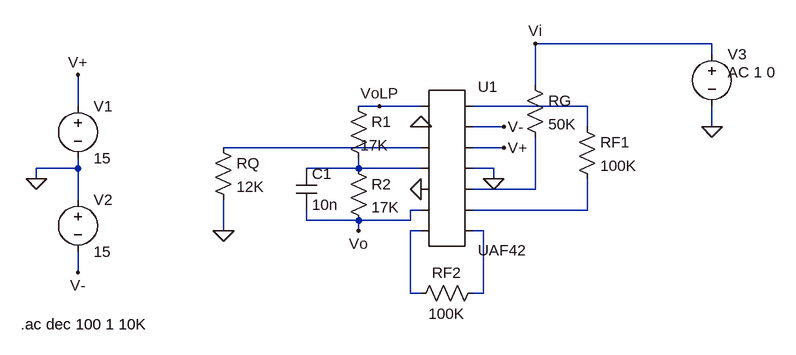
[diagram p0: schematic UAF42.asc]
UAF42.asc, the LTspice schematic file:
Version 4
SHEET 1 948 680
WIRE 848 -80 576 -80
WIRE 848 -64 848 -80
WIRE 576 -16 576 -80
WIRE -128 16 -128 -32
WIRE 336 16 304 16
WIRE 400 16 336 16
WIRE 656 16 480 16
WIRE 528 48 480 48
WIRE 656 48 656 16
WIRE 848 48 848 16
WIRE 400 80 96 80
WIRE 528 80 480 80
WIRE -128 112 -128 96
WIRE -128 112 -192 112
WIRE 304 112 304 96
WIRE 304 112 224 112
WIRE 400 112 304 112
WIRE 512 112 480 112
WIRE -192 128 -192 112
WIRE 512 128 512 112
WIRE 576 144 576 64
WIRE 576 144 480 144
WIRE -128 160 -128 112
WIRE 400 176 384 176
WIRE 656 176 656 128
WIRE 656 176 480 176
WIRE 224 192 224 176
WIRE 304 192 224 192
WIRE 384 192 384 176
WIRE 384 192 304 192
WIRE 96 208 96 160
WIRE 304 208 304 192
WIRE 400 208 384 208
WIRE 496 208 480 208
WIRE -128 272 -128 240
WIRE 384 304 384 208
WIRE 400 304 384 304
WIRE 496 304 496 208
WIRE 496 304 480 304
FLAG 576 -80 Vi
FLAG 96 208 0
FLAG 528 80 V+
FLAG -128 -32 V+
FLAG 528 48 V-
FLAG -128 272 V-
FLAG -192 128 0
FLAG 512 128 0
FLAG 336 16 VoLP
FLAG 304 208 Vo
FLAG 848 48 0
FLAG 400 48 0
FLAG 400 144 0
SYMBOL AutoGenerated\\UAF42 432 112 R0
SYMATTR InstName U1
SYMBOL res 640 32 R0
SYMATTR InstName RF1
SYMATTR Value 100K
SYMBOL res 496 288 R90
WINDOW 0 0 56 VBottom 2
WINDOW 3 32 56 VTop 2
SYMATTR InstName RF2
SYMATTR Value 100K
SYMBOL res 560 -32 R0
SYMATTR InstName RG
SYMATTR Value 50K
SYMBOL res 80 64 R0
SYMATTR InstName RQ
SYMATTR Value 12K
SYMBOL voltage -128 0 R0
SYMATTR InstName V1
SYMATTR Value 15
SYMBOL voltage -128 144 R0
SYMATTR InstName V2
SYMATTR Value 15
SYMBOL res 288 0 R0
WINDOW 3 19 76 Left 2
SYMATTR Value 17K
SYMATTR InstName R1
SYMBOL res 288 96 R0
SYMATTR InstName R2
SYMATTR Value 17K
SYMBOL cap 208 112 R0
SYMATTR InstName C1
SYMATTR Value 10n
SYMBOL voltage 848 -80 R0
WINDOW 123 24 44 Left 2
WINDOW 39 0 0 Left 0
SYMATTR Value2 AC 1 0
SYMATTR InstName V3
SYMATTR Value ""
TEXT -216 352 Left 2 !.ac dec 100 1 10K

The netlist it stands for:
* UAF42.asc
* U1: UAF42 (symbol AutoGenerated\UAF42 not available, pins judged from their places): pin1=VoLP pin2=0 pin3=N002 pin4=N003 pin5=0 pin6=Vo pin7=N006 pin8=N001 pin9=V- pin10=V+ pin11=0 pin12=N004 pin13=N005 pin14=N007
RF1 N001 N005 100K
RF2 N007 N006 100K
RG Vi N004 50K
RQ N002 0 12K
V1 V+ 0 15
V2 0 V- 15
R1 VoLP N003 17K
R2 N003 Vo 17K
C1 N003 Vo 10n
V3 Vi 0 AC 1 0
.ac dec 100 1 10K
.backanno
.end